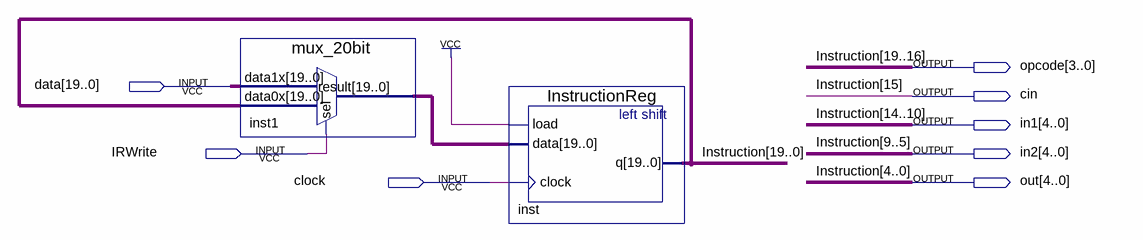
[diagram p0: schematic sheet]
// Quartus schematic IR.bdf as structural Verilog: 2 symbols, 8 pins
module IR (
  input  [19:0] data,
  input  IRWrite,
  input  clock,
  output [3:0] opcode,
  output cin,
  output [4:0] in1,
  output [4:0] in2,
  output [4:0] out
);

  wire [19:0] inst1_result;

  mux_20bit inst1 (.data1x(data), .data0x({opcode, cin, in1, in2, out}), .sel(IRWrite), .result(inst1_result));
  InstructionReg inst (.load(1'b1), .data(inst1_result), .clock(clock), .q({opcode, cin, in1, in2, out}));

  // Other names for the same wires on the sheet: Instruction[19:0] = {opcode, cin, in1, in2, out}
endmodule
